# Altium schematic sheet POWER.SchDoc
size A3
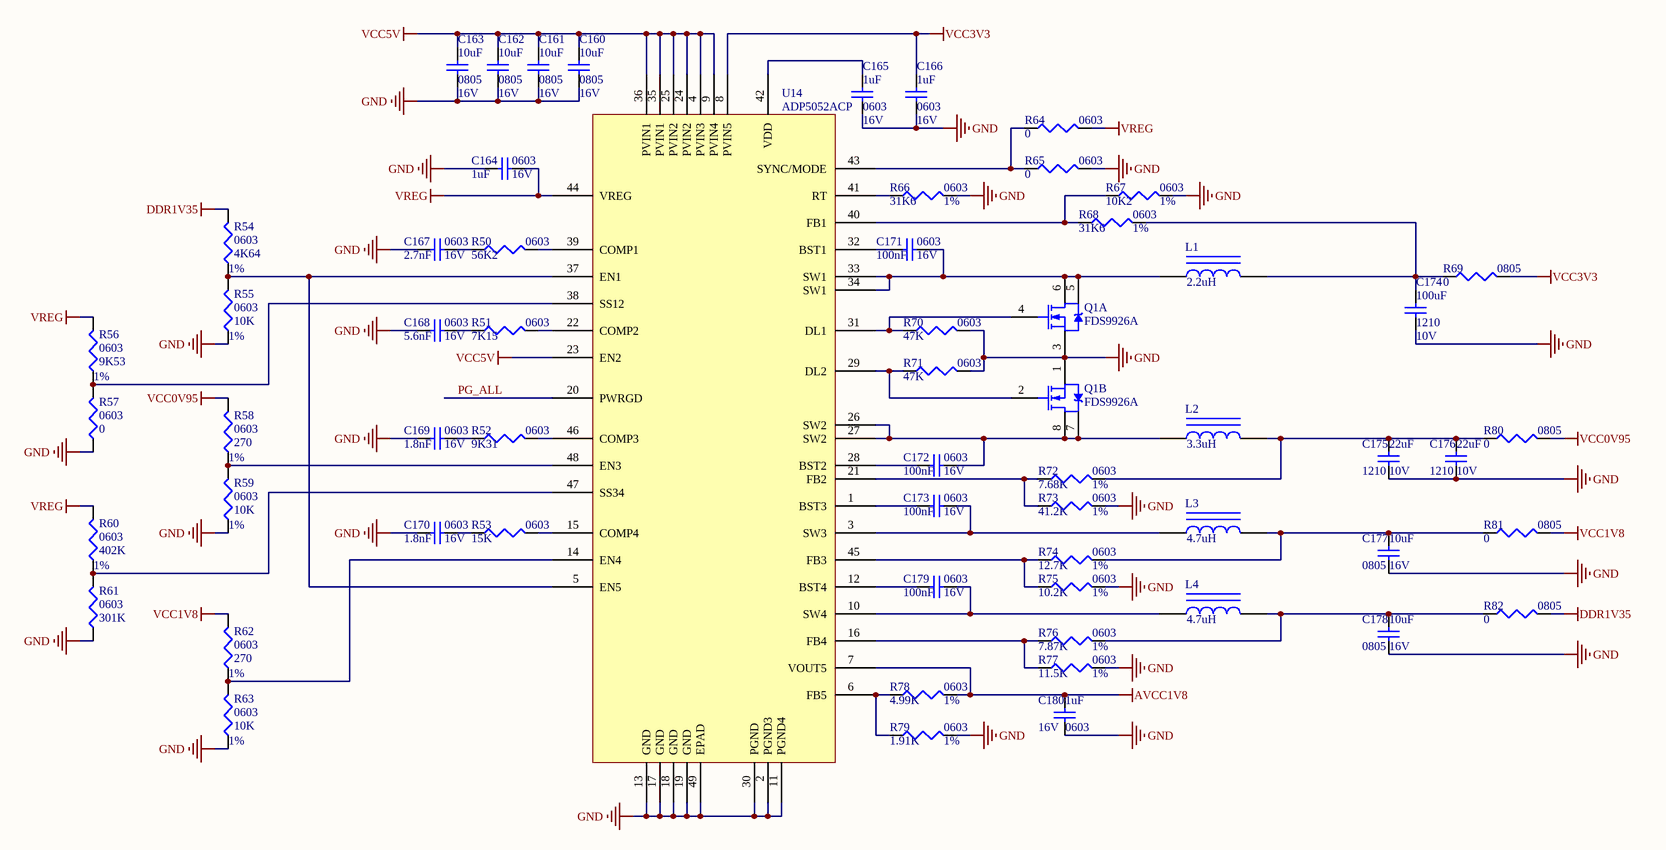
[diagram p0: POWER.SchDoc]

## Parts
C160  PackageReference: 0805  V: 16V  [2012[0805]]  (hidden comment: 10uF)
C161  PackageReference: 0805  V: 16V  [2012[0805]]  (hidden comment: 10uF)
C162  PackageReference: 0805  V: 16V  [2012[0805]]  (hidden comment: 10uF)
C163  PackageReference: 0805  V: 16V  [2012[0805]]  (hidden comment: 10uF)
C164  PackageReference: 0603  V: 16V  [1608[0603]]  (hidden comment: 1uF)
C165  PackageReference: 0603  V: 16V  [1608[0603]]  (hidden comment: 1uF)
C166  PackageReference: 0603  V: 16V  [1608[0603]]  (hidden comment: 1uF)
C167  PackageReference: 0603  V: 16V  [1608[0603]]  (hidden comment: 2.7nF)
C168  PackageReference: 0603  V: 16V  [1608[0603]]  (hidden comment: 5.6nF)
C169  PackageReference: 0603  V: 16V  [1608[0603]]  (hidden comment: 1.8nF)
C170  PackageReference: 0603  V: 16V  [1608[0603]]  (hidden comment: 1.8nF)
C171  PackageReference: 0603  V: 16V  [1608[0603]]  (hidden comment: 100nF)
C172  PackageReference: 0603  V: 16V  [1608[0603]]  (hidden comment: 100nF)
C173  PackageReference: 0603  V: 16V  [1608[0603]]  (hidden comment: 100nF)
C174  PackageReference: 1210  V: 10V  [2012[0805]]  (hidden comment: 100uF)
C175  PackageReference: 1210  V: 10V  [2012[0805]]  (hidden comment: 22uF)
C176  PackageReference: 1210  V: 10V  [2012[0805]]  (hidden comment: 22uF)
C177  PackageReference: 0805  V: 16V  [2012[0805]]  (hidden comment: 10uF)
C178  PackageReference: 0805  V: 16V  [2012[0805]]  (hidden comment: 10uF)
C179  PackageReference: 0603  V: 16V  [1608[0603]]  (hidden comment: 100nF)
C180  PackageReference: 0603  V: 16V  [1608[0603]]  (hidden comment: 1uF)
L1  value 2.2uH  [SRN6045]  (hidden comment: Inductor Iron)
L2  value 3.3uH  [SRN4018]  (hidden comment: Inductor Iron)
L3  value 4.7uH  [SRN4018]  (hidden comment: Inductor Iron)
L4  value 4.7uH  [SRN4018]  (hidden comment: Inductor Iron)
Q1  FDS9926A  [FDS9926A]  (parts A,B of 2)
R50  value 56K2  PackageReference: 0603  [1608[0603]]  (hidden comment: Res3)
R51  value 7K15  PackageReference: 0603  [1608[0603]]  (hidden comment: Res3)
R52  value 9K31  PackageReference: 0603  [1608[0603]]  (hidden comment: Res3)
R53  value 15K  PackageReference: 0603  [1608[0603]]  (hidden comment: Res3)
R54  value 4K64  PackageReference: 0603  AC: 1%  [1608[0603]]  (hidden comment: Res3)
R55  value 10K  PackageReference: 0603  AC: 1%  [1608[0603]]  (hidden comment: Res3)
R56  value 9K53  PackageReference: 0603  AC: 1%  [1608[0603]]  (hidden comment: Res3)
R57  value 0  PackageReference: 0603  [1608[0603]]  (hidden comment: Res3)
R58  value 270  PackageReference: 0603  AC: 1%  [1608[0603]]  (hidden comment: Res3)
R59  value 10K  PackageReference: 0603  AC: 1%  [1608[0603]]  (hidden comment: Res3)
R60  value 402K  PackageReference: 0603  AC: 1%  [1608[0603]]  (hidden comment: Res3)
R61  value 301K  PackageReference: 0603  [1608[0603]]  (hidden comment: Res3)
R62  value 270  PackageReference: 0603  AC: 1%  [1608[0603]]  (hidden comment: Res3)
R63  value 10K  PackageReference: 0603  AC: 1%  [1608[0603]]  (hidden comment: Res3)
R64  value 0  PackageReference: 0603  [1608[0603]]  (hidden comment: Res3)
R65  value 0  PackageReference: 0603  [1608[0603]]  (hidden comment: Res3)
R66  value 31K6  PackageReference: 0603  AC: 1%  [1608[0603]]  (hidden comment: Res3)
R67  value 10K2  PackageReference: 0603  AC: 1%  [1608[0603]]  (hidden comment: Res3)
R68  value 31K6  PackageReference: 0603  AC: 1%  [1608[0603]]  (hidden comment: Res3)
R69  value 0  PackageReference: 0805  [2012[0805]]  (hidden comment: Res3)
R70  value 47K  PackageReference: 0603  [1608[0603]]  (hidden comment: Res3)
R71  value 47K  PackageReference: 0603  [1608[0603]]  (hidden comment: Res3)
R72  value 7.68K  PackageReference: 0603  AC: 1%  [1608[0603]]  (hidden comment: Res3)
R73  value 41.2K  PackageReference: 0603  AC: 1%  [1608[0603]]  (hidden comment: Res3)
R74  value 12.7K  PackageReference: 0603  AC: 1%  [1608[0603]]  (hidden comment: Res3)
R75  value 10.2K  PackageReference: 0603  AC: 1%  [1608[0603]]  (hidden comment: Res3)
R76  value 7.87K  PackageReference: 0603  AC: 1%  [1608[0603]]  (hidden comment: Res3)
R77  value 11.5K  PackageReference: 0603  AC: 1%  [1608[0603]]  (hidden comment: Res3)
R78  value 4.99K  PackageReference: 0603  AC: 1%  [1608[0603]]  (hidden comment: Res3)
R79  value 1.91K  PackageReference: 0603  AC: 1%  [1608[0603]]  (hidden comment: Res3)
R80  value 0  PackageReference: 0805  [2012[0805]]  (hidden comment: Res3)
R81  value 0  PackageReference: 0805  [2012[0805]]  (hidden comment: Res3)
R82  value 0  PackageReference: 0805  [2012[0805]]  (hidden comment: Res3)
U14  ADP5052ACP  [ADP5052]

## Nets
AVCC1V8: C180.1 R78.2 U14.7(VOUT5)
DDR1V35: R54.2 R82.2
GND: C160.2 C161.2 C162.2 C163.2 C164.2 C165.2 C166.2 C167.2 C168.2 C169.2 C170.2 C174.1 C175.2 C176.2 C177.2 C178.2 C180.2 Q1.1(S) Q1.3(S) R55.1 R57.1 R59.1 R61.1 R63.1 R65.2 R66.2 R67.2 R70.2 R71.2 R73.2 R75.2 R77.2 R79.2 U14.2(PGND3) U14.11(PGND4) U14.13(GND) U14.17(GND) U14.18(GND) U14.19(GND) U14.30(PGND) U14.49(EPAD)
VCC0V95: R58.2 R80.2
VCC1V8: R62.2 R81.2
VCC3V3: C166.1 R69.2 U14.8(PVIN5)
VCC5V: C160.1 C161.1 C162.1 C163.1 U14.4(PVIN3) U14.9(PVIN4) U14.23(EN2) U14.24(PVIN2) U14.25(PVIN2) U14.35(PVIN1) U14.36(PVIN1)
VREG: C164.1 R56.2 R60.2 R64.2 U14.44(VREG)
PG_ALL: U14.20(PWRGD)
NetC165_1: C165.1 U14.42(VDD)
NetC167_1: C167.1 R50.1
NetC168_1: C168.1 R51.1
NetC169_1: C169.1 R52.1
NetC170_1: C170.1 R53.1
NetC171_1: C171.1 U14.32(BST1)
NetC171_2: C171.2 L1.1 Q1.5(D) Q1.6(D) U14.33(SW1) U14.34(SW1)
NetC172_1: C172.1 U14.28(BST2)
NetC172_2: C172.2 L2.1 Q1.7(D) Q1.8(D) U14.26(SW2) U14.27(SW2)
NetC173_1: C173.1 U14.1(BST3)
NetC173_2: C173.2 L3.1 U14.3(SW3)
NetC174_2: C174.2 L1.2 R68.2 R69.1
NetC175_1: C175.1 C176.1 L2.2 R72.2 R80.1
NetC177_1: C177.1 L3.2 R74.2 R81.1
NetC178_1: C178.1 L4.2 R76.2 R82.1
NetC179_1: C179.1 U14.12(BST4)
NetC179_2: C179.2 L4.1 U14.10(SW4)
NetQ1_2: Q1.2(G) R71.1 U14.29(DL2)
NetQ1_4: Q1.4(G) R70.1 U14.31(DL1)
NetR50_2: R50.2 U14.39(COMP1)
NetR51_2: R51.2 U14.22(COMP2)
NetR52_2: R52.2 U14.46(COMP3)
NetR53_2: R53.2 U14.15(COMP4)
NetR54_1: R54.1 R55.2 U14.5(EN5) U14.37(EN1)
NetR56_1: R56.1 R57.2 U14.38(SS12)
NetR58_1: R58.1 R59.2 U14.48(EN3)
NetR60_1: R60.1 R61.2 U14.47(SS34)
NetR62_1: R62.1 R63.2 U14.14(EN4)
NetR64_1: R64.1 R65.1 U14.43(SYNC/MODE)
NetR66_1: R66.1 U14.41(RT)
NetR67_1: R67.1 R68.1 U14.40(FB1)
NetR72_1: R72.1 R73.1 U14.21(FB2)
NetR74_1: R74.1 R75.1 U14.45(FB3)
NetR76_1: R76.1 R77.1 U14.16(FB4)
NetR78_1: R78.1 R79.1 U14.6(FB5)

## Library data of the parts
C160-C180 = Cap Semi: Capacitor (Semiconductor SIM Model); LatestRevisionDate: 17-Jul-2002; LatestRevisionNote: Re-released for DXP Platform.; Publisher: Altium Limited
  C160-C163 C177 C178: Value: 10uF
  C164-C166 C180: Value: 1uF
  C167: Value: 2.7nF
  C168: Value: 5.6nF
  C169 C170: Value: 1.8nF
  C171-C173 C179: Value: 100nF
  C174: Value: 100uF
  C175 C176: Value: 22uF
L1-L4 = Inductor Iron: Magnetic-Core Inductor; Published: 24-Mar-1999; LatestRevisionDate: 17-Jul-2002; LatestRevisionNote: Re-released for DXP Platform.; PackageReference: AXIAL-0.9; Publisher: Altium Limited
R50-R56 R58-R60 R62-R69 R72-R82 = Res3: Resistor; Published: 8-Jun-2000; LatestRevisionDate: 29-May-2009; LatestRevisionNote: IPC-7351 Footprint Added.; Publisher: Altium Limited; PackageDescription: Chip Resistor
R57 R61 R70 R71 = Res3: Resistor; AC: 1%; Published: 8-Jun-2000; LatestRevisionDate: 29-May-2009; LatestRevisionNote: IPC-7351 Footprint Added.; Publisher: Altium Limited; PackageDescription: Chip Resistor
U14 = ADP5052ACP\